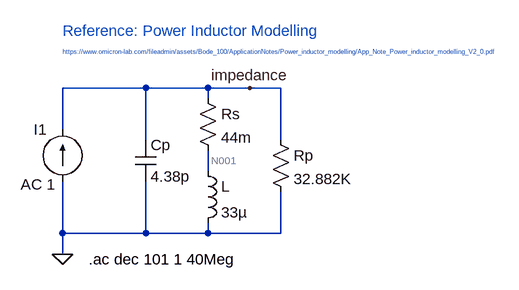
[diagram p0: schematic 01-33uH_model_omicron_lab.asc]
01-33uH_model_omicron_lab.asc, the LTspice schematic file:
Version 4
SHEET 1 1168 680
WIRE 96 64 -32 64
WIRE 192 64 96 64
WIRE 256 64 192 64
WIRE 304 64 256 64
WIRE 192 80 192 64
WIRE -32 128 -32 64
WIRE 96 144 96 64
WIRE 304 144 304 64
WIRE 192 192 192 160
WIRE -32 288 -32 208
WIRE 96 288 96 208
WIRE 96 288 -32 288
WIRE 192 288 192 272
WIRE 192 288 96 288
WIRE 304 288 304 224
WIRE 304 288 192 288
WIRE -32 320 -32 288
FLAG -32 320 0
FLAG 256 64 impedance
SYMBOL res 176 64 R0
SYMATTR InstName Rs
SYMATTR Value 44m
SYMBOL ind 176 176 R0
SYMATTR InstName L
SYMATTR Value 33µ
SYMBOL cap 80 144 R0
SYMATTR InstName Cp
SYMATTR Value 4.38p
SYMBOL res 288 128 R0
SYMATTR InstName Rp
SYMATTR Value 32.882K
SYMBOL current -32 208 R180
WINDOW 0 24 80 Left 2
WINDOW 3 24 0 Left 2
WINDOW 123 11 -5 Left 2
WINDOW 39 0 0 Left 0
SYMATTR InstName I1
SYMATTR Value ""
SYMATTR Value2 AC 1
TEXT 8 328 Left 2 !.ac dec 101 1 40Meg
TEXT -32 -24 Left 2 ;Reference: Power Inductor Modelling
TEXT -32 8 Left 0 ;https://www.omicron-lab.com/fileadmin/assets/Bode_100/ApplicationNotes/Power_inductor_modelling/App_Note_Power_inductor_modelling_V2_0.pdf

The netlist it stands for:
* 01-33uH_model_omicron_lab.asc
Rs impedance N001 44m
L N001 0 33µ
Cp impedance 0 4.38p
Rp impedance 0 32.882K
I1 0 impedance AC 1
.ac dec 101 1 40Meg
* Reference: Power Inductor Modelling
* https://www.omicron-lab.com/fileadmin/assets/Bode_100/ApplicationNotes/Power_inductor_modelling/App_Note_Power_inductor_modelling_V2_0.pdf
.backanno
.end

* Results of the author's LTspice run, read from the files saved beside the schematic
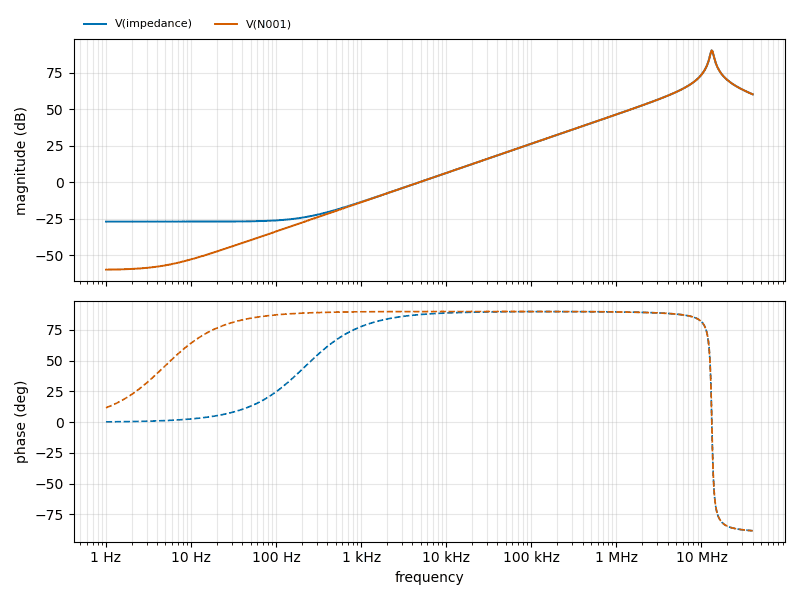
[diagram p1: AC Analysis of 01-33uH_model_omicron_lab.asc, plotted from the saved traces]
* AC Analysis, 1 run:
*   V(impedance): -26.94 dB at 1 Hz, 60.17 dB at 40 MHz, peak 90.22 dB at 13.15 MHz, 3 dB below the peak at 12.68 MHz and 13.82 MHz
*   V(N001): -59.82 dB at 1 Hz, 60.17 dB at 40 MHz, peak 90.22 dB at 13.15 MHz, 3 dB below the peak at 12.68 MHz and 13.82 MHz